# Altium project PCB_Project.PrjPcb
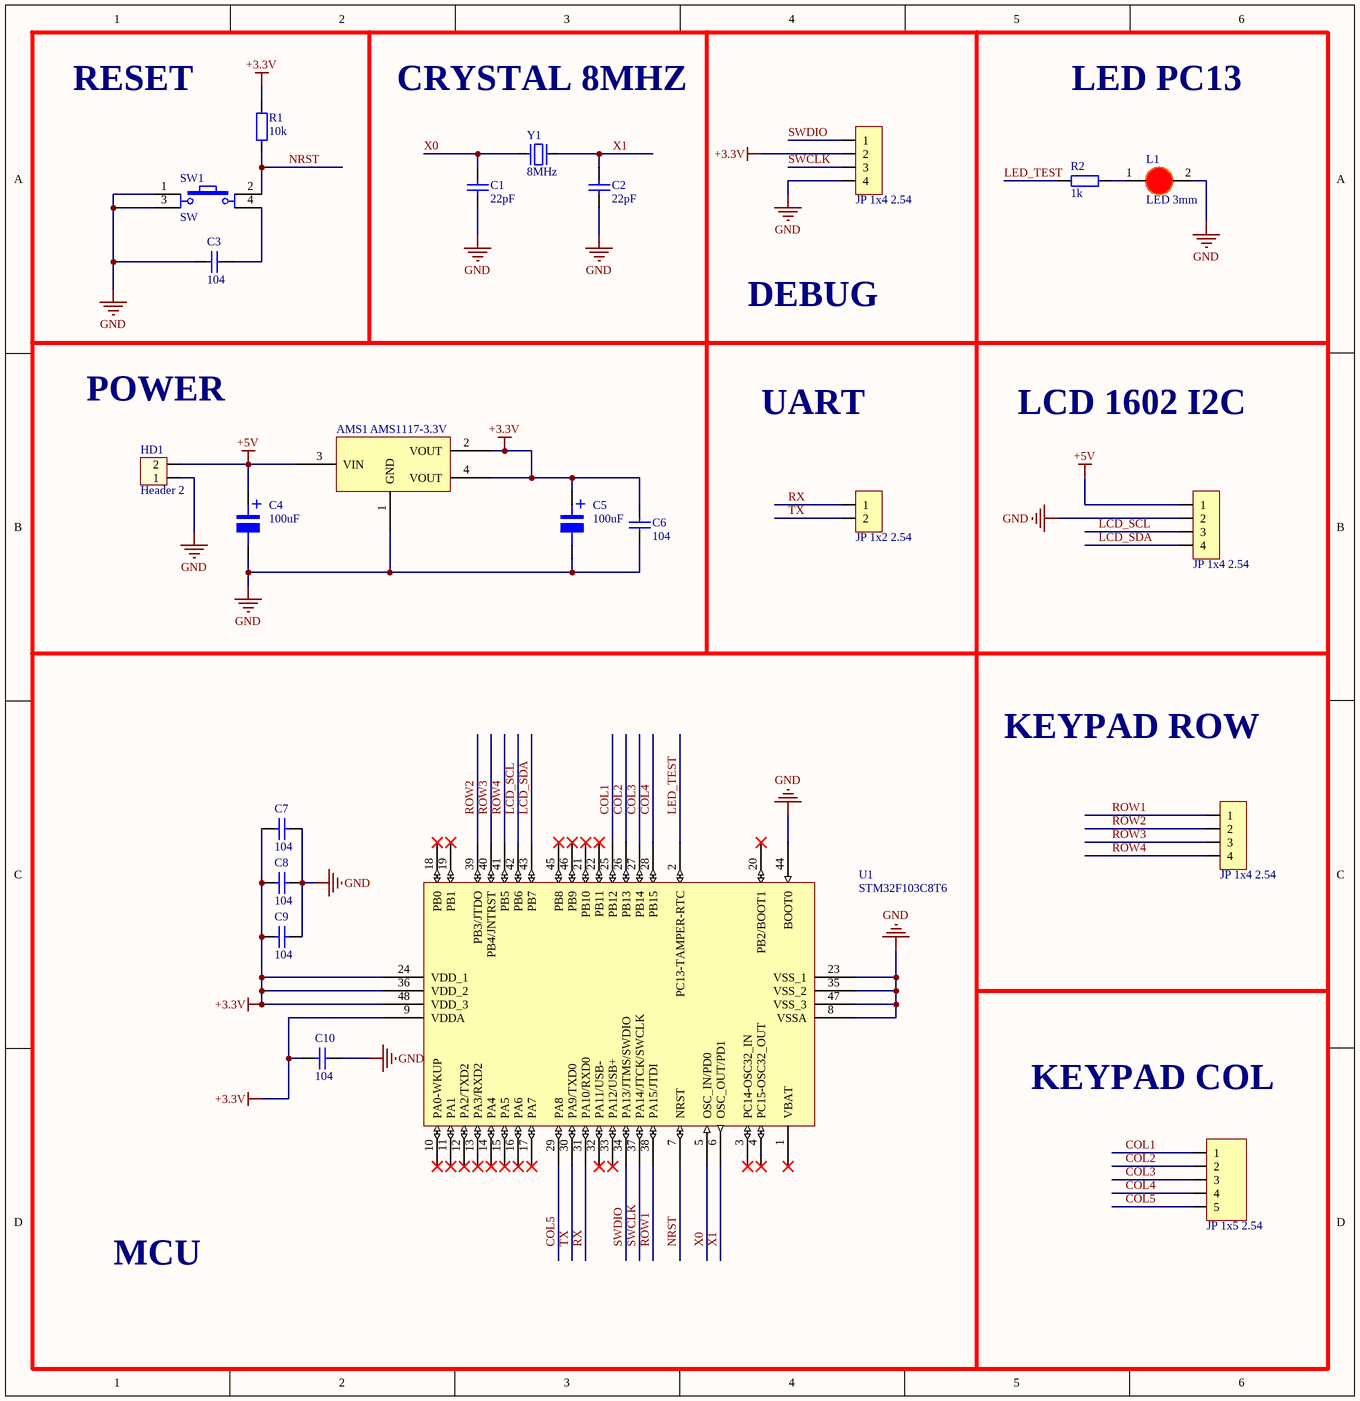
[diagram p0: MCU.SchDoc]
1 sheet, 23 parts. Net scope: global (net labels, ports and power ports of the same name join across sheets).

## Sheet MCU.SchDoc
size 254 x 261 mm; SheetNumber: 1; SheetTotal: 1

### Parts
AMS1  AMS1117-3.3V  [SOT223]
C1  22pF  [tu 1206]
C2  22pF  [tu 1206]
C3  104  [tu 1206]
C4  100uF  [tu nhom 6.3 (d)]
C5  100uF  [tu nhom 6.3 (d)]
C6  104  [tu 1206]
C7  104  [tu 1206]
C8  104  [tu 1206]
C9  104  [tu 1206]
C10  104  [tu 1206]
HD1  Header 2  [HED2]
JP1  JP 1x4 2.54  [JP 1x4 DT]
JP2  JP 1x2 2.54  [JP 1x2 DT]
JP3  JP 1x4 2.54  [JP 1x4 DT]
JP4  JP 1x4 2.54  [JP 1x4 DT]
JP5  JP 1x5 2.54  [JP 1x5 DT]
L1  LED 3mm  [LED-3MM-RED]
R1  10k  [tro smd 1206]
R2  1k  [tro smd 1206]
SW1  SW  [SW4]
U1  STM32F103C8T6  [LQFP48]
Y1  8MHz  [Thach Anh 2 chan SMD]

### Nets
+3.3V: AMS1.2(VOUT) AMS1.4(VOUT) C5.1 C6.1 C7.1 C8.1 C9.1 C10.1 JP1.2 R1.2 U1.9(VDDA) U1.24(VDD_1) U1.36(VDD_2) U1.48(VDD_3)
+5V: AMS1.3(VIN) C4.1 HD1.2 JP3.1
GND: AMS1.1(GND) C1.2 C2.2 C3.1 C4.2 C5.2 C6.2 C7.2 C8.2 C9.2 C10.2 HD1.1 JP1.4 JP3.2 L1.2(K) SW1.1 SW1.3 U1.8(VSSA) U1.23(VSS_1) U1.35(VSS_2) U1.44(BOOT0) U1.47(VSS_3)
COL1: JP5.1 U1.25(PB12)
COL2: JP5.2 U1.26(PB13)
COL3: JP5.3 U1.27(PB14)
COL4: JP5.4 U1.28(PB15)
COL5: JP5.5 U1.29(PA8)
LCD_SCL: JP3.3 U1.42(PB6)
LCD_SDA: JP3.4 U1.43(PB7)
LED_TEST: R2.1 U1.2(PC13-TAMPER-RTC)
NRST: R1.1 SW1.2 U1.7(NRST)
ROW1: JP4.1 U1.38(PA15/JTDI)
ROW2: JP4.2 U1.39(PB3/JTDO)
ROW3: JP4.3 U1.40(PB4/JNTRST)
ROW4: JP4.4 U1.41(PB5)
RX: JP2.1 U1.31(PA10/RXD0)
SWCLK: JP1.3 U1.37(PA14/JTCK/SWCLK)
SWDIO: JP1.1 U1.34(PA13/JTMS/SWDIO)
TX: JP2.2 U1.30(PA9/TXD0)
X0: C1.1 U1.5(OSC_IN/PD0) Y1.1
X1: C2.1 U1.6(OSC_OUT/PD1) Y1.2
NetC3_2: C3.2 SW1.4
NetL1_1: L1.1(A) R2.2

Not connected (* = marked no-connect by the designer): U1 1(VBAT)* 3(PC14-OSC32_IN)* 4(PC15-OSC32_OUT)* 10(PA0-WKUP)* 11(PA1)* 12(PA2/TXD2)* 13(PA3/RXD2)* 14(PA4)* 15(PA5)* 16(PA6)* 17(PA7)* 18(PB0)* 19(PB1)* 20(PB2/BOOT1)* 21(PB10)* 22(PB11)* 32(PA11/USB-)* 33(PA12/USB+)* 45(PB8)* 46(PB9)*

### Notes on the sheet
- RESET
- CRYSTAL 8MHZ
- LED PC13
- DEBUG
- POWER
- UART
- LCD 1602 I2C
- KEYPAD ROW
- KEYPAD COL
- MCU
- (in symbol Tu Nhom 100uF 16V) +

### Library data of the parts
AMS1 = AMS1117 SMD: Dán; Value: AMS1117-3.3V SOT223; Don_Vi: Con; Ma_Hang: MH000596; Ghi_Chu: *; Kieu_Chan: *; Chung_Loai: Dán
C1 C2 = Tu 1206 22pF 50V 10%: Dán; Ma_Hang: MH004547; Don_Vi: Con; So_Chan: 2; Ten_Linh_Kien: Tụ 1206 22P 10% 50V; Chung_Loai: Dán; Kieu_Chan: *
C3 C6-C10 = Tu 1206 104 50V 20%: Dán; Don_Vi: Con; So_Chan: 2; Ten_Linh_Kien: Tụ 1206 104-0.1uF 20% 50V; Ma_Hang: MH004544; Chung_Loai: Dán; Kieu_Chan: *
C4 C5 = Tu Nhom 100uF 16V: Dán; Don_Vi: Con; So_Chan: 2; Ten_Linh_Kien: Tụ Nhôm 100uF 16V 6.3x5.4MM; Ma_Hang: MH002219; Chung_Loai: Dán; Kieu_Chan: *
HD1 = Hed2: Header 2 (Green); Value: Header 2
JP1 JP3 JP4 = JP 1x4 2.54 Duc Thang: Cắm; Ten_Linh_Kien: Jump Đơn Đực 2.54MM 1x40P Thẳng 11MM; Don_Vi: Con; Ma_Hang: MH000903; Ghi_Chu: *; Kieu_Chan: *; Chung_Loai: Cắm
JP2 = JP 1x2 2.54 Duc Thang: Cắm; Ten_Linh_Kien: Jump Đơn Đực 2.54MM 1x40P Thẳng 11MM; Don_Vi: Con; Ma_Hang: MH000903; Ghi_Chu: *; Kieu_Chan: *; Chung_Loai: Cắm
JP5 = JP 1x5 2.54 Duc Thang: Cắm; Ten_Linh_Kien: Jump Đơn Đực 2.54MM 1x40P Thẳng 11MM; Don_Vi: Con; Ma_Hang: MH000903; Ghi_Chu: *; Kieu_Chan: *; Chung_Loai: Cắm
L1 = LED 3mm Do: Cắm; Don_Vi: Con; Ma_Hang: MH003892; Ten_Linh_Kien: Led 3MM Phủ Đỏ (10c); Ghi_Chu: *; Kieu_Chan: *; Chung_Loai: Cắm
R1 = Tro 1206 1% 10k: Dán; Don_Vi: Con; So_Chan: 2; Ten_Linh_Kien: Trở 1206 1% 10k; Ma_Hang: MH005885; Chung_Loai: Dán; Kieu_Chan: *
R2 = Tro 1206 1% 1k: Dán; Don_Vi: Con; So_Chan: 2; Ten_Linh_Kien: Trở 1206 1% 1k; Ma_Hang: MH005880; Chung_Loai: Dán; Kieu_Chan: *
SW1 = SW4: Switch button 4 pin; Value: Button chip 4 pin
U1 = STM32F103C8T6: STM32 ARM-based 32-bit MCU with ARM 32-bit Cortex-M3 Microcontroller, 128 Kbytes Flash, 48-pin LQFP, Industrial Temperature; Published: 30-May-2008; DatasheetVersion: rev6, Mar-2008; PackageVersion: Mar-2008; PackageReference: LQFP48; Publisher: Altium Limited; PackageDescription: 48-Pin Low-Profile Quad Flat Pack, 7 x 7 mm Body, 0.5 mm Pitch (LQFP48); ComponentLink1Description: Manufacturer Link; ComponentLink1URL: www.st.com/stm32; ComponentLink2Description: Datasheet; ComponentLink2URL: http://www.st.com/stonline/products/literature/ds/13586.pdf
Y1 = Thach Anh 2 chan SMD: Crystal For all Crystal 2pin.; Value: 4Mhz